# EAGLE design AirU_v2.2 (EAGLE 9.6.2)
COMPANY: ADAFRUIT INDUSTRIES; DRAWN: KTOWN; REV: B

## Sheet 1 of 2
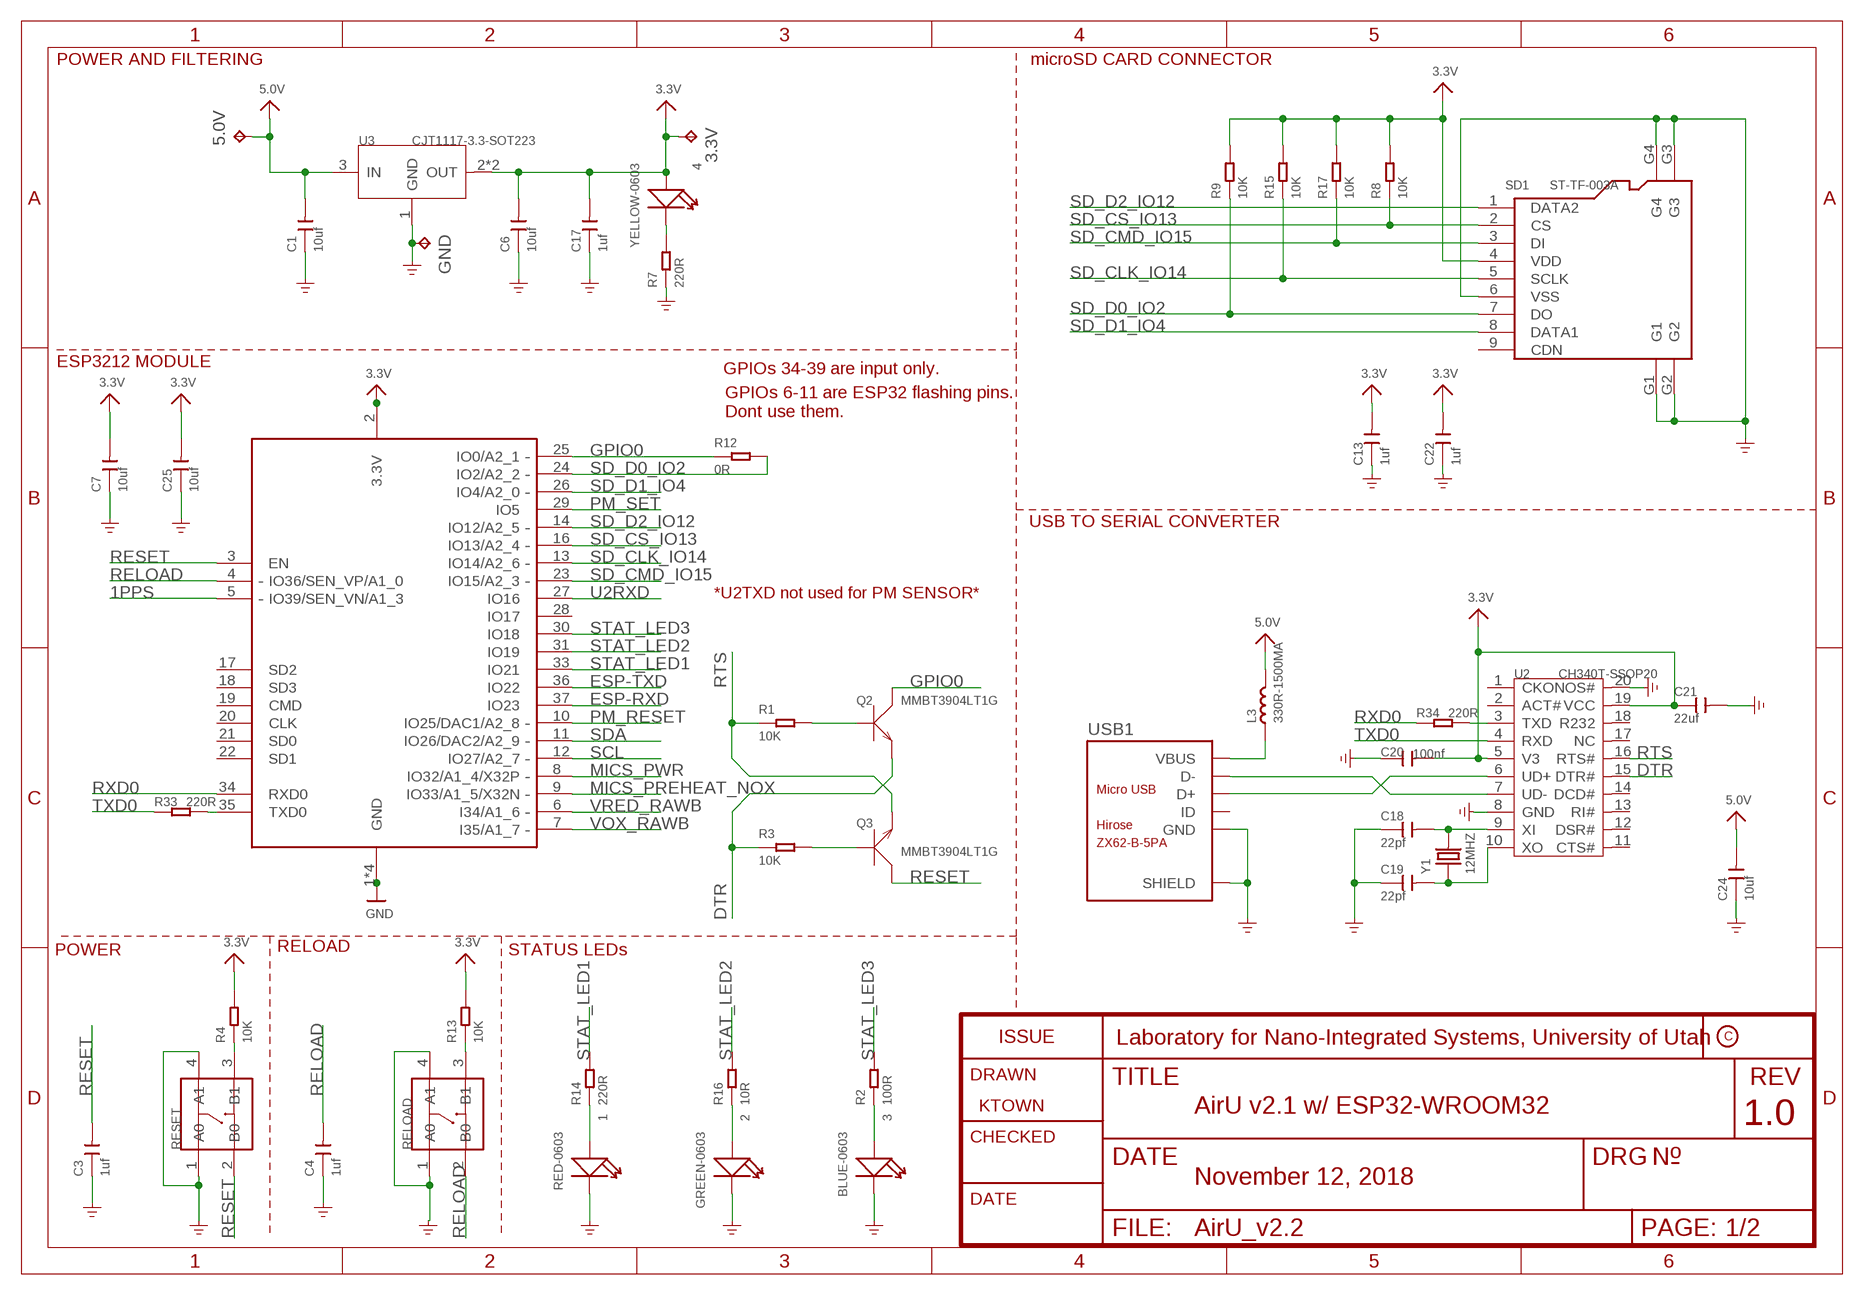
[diagram p0: schematic, sheet 1]
FRAME1 (FRAME_A4): COMPANY: TETRAD: SENSOR NETWORK SOLUTIONS, LLC; REV: 1.0

### Parts
1  RED-0603  LED-SMD-RED-DIFFUSED(0603)  [LED-0603]
2  GREEN-0603  SMD-LED-CLEAR-GREEN(0603)  [LED-0603]
3  BLUE-0603  SMD-LED-CLEAR-BLUE(0603)  [LED-0603]
3.3V  TPTP20SQ  [TP20SQ]
4  YELLOW-0603  SMD-LED-CLEAR-YELLOW(0603)  [LED-0603]
5.0V  TPTP20SQ  [TP20SQ]
C1  10uf  CERAMIC-10UF-10V-10%-X5R(0603)  [C0603]
C3  1uf  CERAMIC-1UF-25V-10%-X7R(0603)  [C0603]
C4  1uf  CERAMIC-1UF-25V-10%-X7R(0603)  [C0603]
C6  10uf  CERAMIC-10UF-10V-10%-X5R(0603)  [C0603]
C7  10uf  CERAMIC-10UF-10V-10%-X5R(0603)  [C0603]
C13  1uf  CERAMIC-1UF-25V-10%-X7R(0603)  [C0603]
C17  1uf  CERAMIC-1UF-25V-10%-X7R(0603)  [C0603]
C18  22pf  CERAMIC-22PF-50V-5%-NPO(0603)  [C0603]
C19  22pf  CERAMIC-22PF-50V-5%-NPO(0603)  [C0603]
C20  100nf  CERAMIC-100NF-50V-10%-X7R(0603)  [C0603]
C21  22uf  CERAMIC-22UF-6.3V-20%-X5R(0805)  [C0805]
C22  1uf  CERAMIC-1UF-25V-10%-X7R(0603)  [C0603]
C24  10uf  CERAMIC-10UF-10V-10%-X5R(0603)  [C0603]
C25  10uf  CERAMIC-10UF-10V-10%-X5R(0603)  [C0603]
GND  TPTP20SQ  [TP20SQ]
L3  330R-1500MA  SMD-FERRITE-BEAD-330R-1500MA(0805)'0805'  [L0805]
Q2  MMBT3904LT1G  SMD-TRANSISTORS-NPN-40V-200MA-MMBT3904LT1G(SOT-23)  [SOT-23]
Q3  MMBT3904LT1G  SMD-TRANSISTORS-NPN-40V-200MA-MMBT3904LT1G(SOT-23)  [SOT-23]
R1  10K  SMD-RES-10K-1%-1/10W(0603)  [R0603]
R2  100R  SMD-RES-100R-5%-1/10W(0603)  [R0603]
R3  10K  SMD-RES-10K-1%-1/10W(0603)  [R0603]
R4  10K  SMD-RES-10K-1%-1/10W(0603)  [R0603]
R7  220R  SMD-RES-220R-5%-1/10W(0603)  [R0603]
R8  10K  SMD-RES-10K-1%-1/10W(0603)  [R0603]
R9  10K  SMD-RES-10K-1%-1/10W(0603)  [R0603]
R12  0R  SMD-RES-0R-5%-1/10W(0603)  [R0603]
R13  10K  SMD-RES-10K-1%-1/10W(0603)  [R0603]
R14  220R  SMD-RES-220R-5%-1/10W(0603)  [R0603]
R15  10K  SMD-RES-10K-1%-1/10W(0603)  [R0603]
R16  10R  SMD-RES-10R-5%-1/10W(0603)  [R0603]
R17  10K  SMD-RES-10K-1%-1/10W(0603)  [R0603]
R33  220R  SMD-RES-220R-5%-1/10W(0603)  [R0603]
R34  220R  SMD-RES-220R-5%-1/10W(0603)  [R0603]
RELOAD  DIP-SWITCH-TACTILE-SPST-NO/TS-1109(4P-D6.0MM)'TS-1109'  [SW4-6.0X6.0X5.0MM]
RESET  DIP-SWITCH-TACTILE-SPST-NO/TS-1109(4P-D6.0MM)'TS-1109'  [SW4-6.0X6.0X5.0MM]
SD1  ST-TF-003A  MICRO-SD-CARD-SOCKET-9P(ST-TF-003A)  [MICRO-SD9+4P-SMD-16.1X14.5X1.85MM]
U2  CH340T-SSOP20  INTERFACE-CH340T(SSOP20)  [SSOP20-0.65-7.6X5.2MM]
U3  CJT1117-3.3-SOT223  PMIC-CJT1117-3.3(SOT223)  [SOT-223]
U7  ESP32_WROOM32_SKINNY  [WROOM32_SKINNY]
USB1  ZX62-B-5PA  MICRO-USB-SMD(ZX62-B-5PA)  [MICRO-USB5+6P-SMD-0.65-AB]
Y1  12MHZ  SMD-CRYSTAL-12MHZ-20PF-20PPM-40R(2P-5.0X3.2MM)  [X2-SMD-5.0X3.2X1.3MM]

### Nets
1PPS: U7.5(IO39/SEN_VN/A1_3) ; also sheet 2
3.3V: 3.3V.TP 4.+ C6.2 C7.2 C13.2 C17.2 C20.2 C21.1 C22.2 C25.2 R4.2 R8.2 R9.2 R13.2 R15.2 R17.2 SD1.4(VDD) U2.5(V3) U2.19(VCC) U3.2(OUT) U3.TER(OUT) U7.2(3.3V) ; also sheet 2
5.0V: 5.0V.TP C1.2 C24.2 L3.2 U3.3(IN) ; also sheet 2
DTR: Q2.2(E) R3.1 U2.15(DTR#)
ESP-RXD: U7.37(IO23) ; also sheet 2
ESP-TXD: U7.36(IO22) ; also sheet 2
GND: 1.- 2.- 3.- C1.1 C3.1 C4.1 C6.1 C7.1 C13.1 C17.1 C18.1 C19.1 C20.1 C21.2 C22.1 C24.1 C25.1 GND.TP R7.1 RELOAD.1(A0) RELOAD.4(A1) RESET.1(A0) RESET.4(A1) SD1.6(VSS) SD1.G1 SD1.G2 SD1.G3 SD1.G4 U2.8(GND) U2.20(NOS#) U3.1(GND) U7.1(GND) U7.15(GND) U7.38(GND) U7.P$1(GND) USB1.5(GND) USB1.P1(SHIELD) USB1.P2(SHIELD) USB1.P3_1(SHIELD) USB1.P3_2(SHIELD) USB1.P3_3(SHIELD) USB1.P4_1(SHIELD) USB1.P4_2(SHIELD) USB1.P4_3(SHIELD) USB1.P5(SHIELD) USB1.P6(SHIELD) ; supply symbol labelled GND_POWER ; also sheet 2
GPIO0: Q2.3(C) R12.1 U7.25(IO0/A2_1)
MICS_PREHEAT_NOX: U7.9(IO33/A1_5/X32N) ; also sheet 2
MICS_PWR: U7.8(IO32/A1_4/X32P) ; also sheet 2
N$1: 2.+ R16.1
N$7: 1.+ R14.1
N$12: Q3.1(B) R3.2
N$13: Q2.1(B) R1.2
N$22: 3.+ R2.1
N$25: 4.- R7.2
N$26: U2.7(UD-) USB1.2(D-)
N$27: U2.6(UD+) USB1.3(D+)
N$28: C18.2 U2.9(XI) Y1.2
N$29: C19.2 U2.10(XO) Y1.1
N$30: R34.2 U2.3(TXD)
N$33: R33.2 U7.35(TXD0)
N$37: R13.1 RELOAD.3(B1)
N$38: R4.1 RESET.3(B1)
PM_RESET: U7.10(IO25/DAC1/A2_8) ; also sheet 2
PM_SET: U7.29(IO5) ; also sheet 2
RELOAD: C4.2 RELOAD.2(B0) U7.4(IO36/SEN_VP/A1_0)
RESET: C3.2 Q3.3(C) RESET.2(B0) U7.3(EN)
RTS: Q3.2(E) R1.1 U2.16(RTS#)
RXD0: R34.1 U7.34(RXD0)
SCL: U7.12(IO27/A2_7) ; also sheet 2
SD_CLK_IO14: R15.1 SD1.5(SCLK) U7.13(IO14/A2_6)
SD_CMD_IO15: R17.1 SD1.3(DI) U7.23(IO15/A2_3)
SD_CS_IO13: R8.1 SD1.2(CS) U7.16(IO13/A2_4)
SD_D0_IO2: R9.1 R12.2 SD1.7(DO) U7.24(IO2/A2_2)
SD_D1_IO4: SD1.8(DATA1) U7.26(IO4/A2_0)
SD_D2_IO12: SD1.1(DATA2) U7.14(IO12/A2_5)
SDA: U7.11(IO26/DAC2/A2_9) ; also sheet 2
STAT_LED1: R14.2 U7.33(IO21)
STAT_LED2: R16.2 U7.31(IO19)
STAT_LED3: R2.2 U7.30(IO18)
TXD0: R33.1 U2.4(RXD)
U2RXD: U7.27(IO16) ; also sheet 2
VBUS: L3.1 USB1.1(VBUS)
VOX_RAWB: U7.7(I35/A1_7) ; also sheet 2
VRED_RAWB: U7.6(I34/A1_6) ; also sheet 2
Unconnected: SD1.9(CDN) U2.1(CKO) U2.2(ACT#) U2.11(CTS#) U2.12(DSR#) U2.13(RI#) U2.14(DCD#) U2.17(NC) U2.18(R232) U7.17(SD2) U7.18(SD3) U7.19(CMD) U7.20(CLK) U7.21(SD0) U7.22(SD1) U7.28(IO17) USB1.4(ID)

### Notes on the sheet
- POWER AND FILTERING | microSD CARD CONNECTOR
- ESP3212 MODULE
- GPIOs 34-39 are input only.
- GPIOs 6-11 are ESP32 flashing pins.
  Dont use them.
- -
- -
- -
- - | USB TO SERIAL CONVERTER
- -
- -
- - | -
- - | *U2TXD not used for PM SENSOR*
- -
- -
- -
- -
- -
- -
- -
- POWER | RELOAD | STATUS LEDs
- Laboratory for Nano-Integrated Systems, University of Utah
- AirU v2.1 w/ ESP32-WROOM32
- November 12, 2018

## Sheet 2 of 2
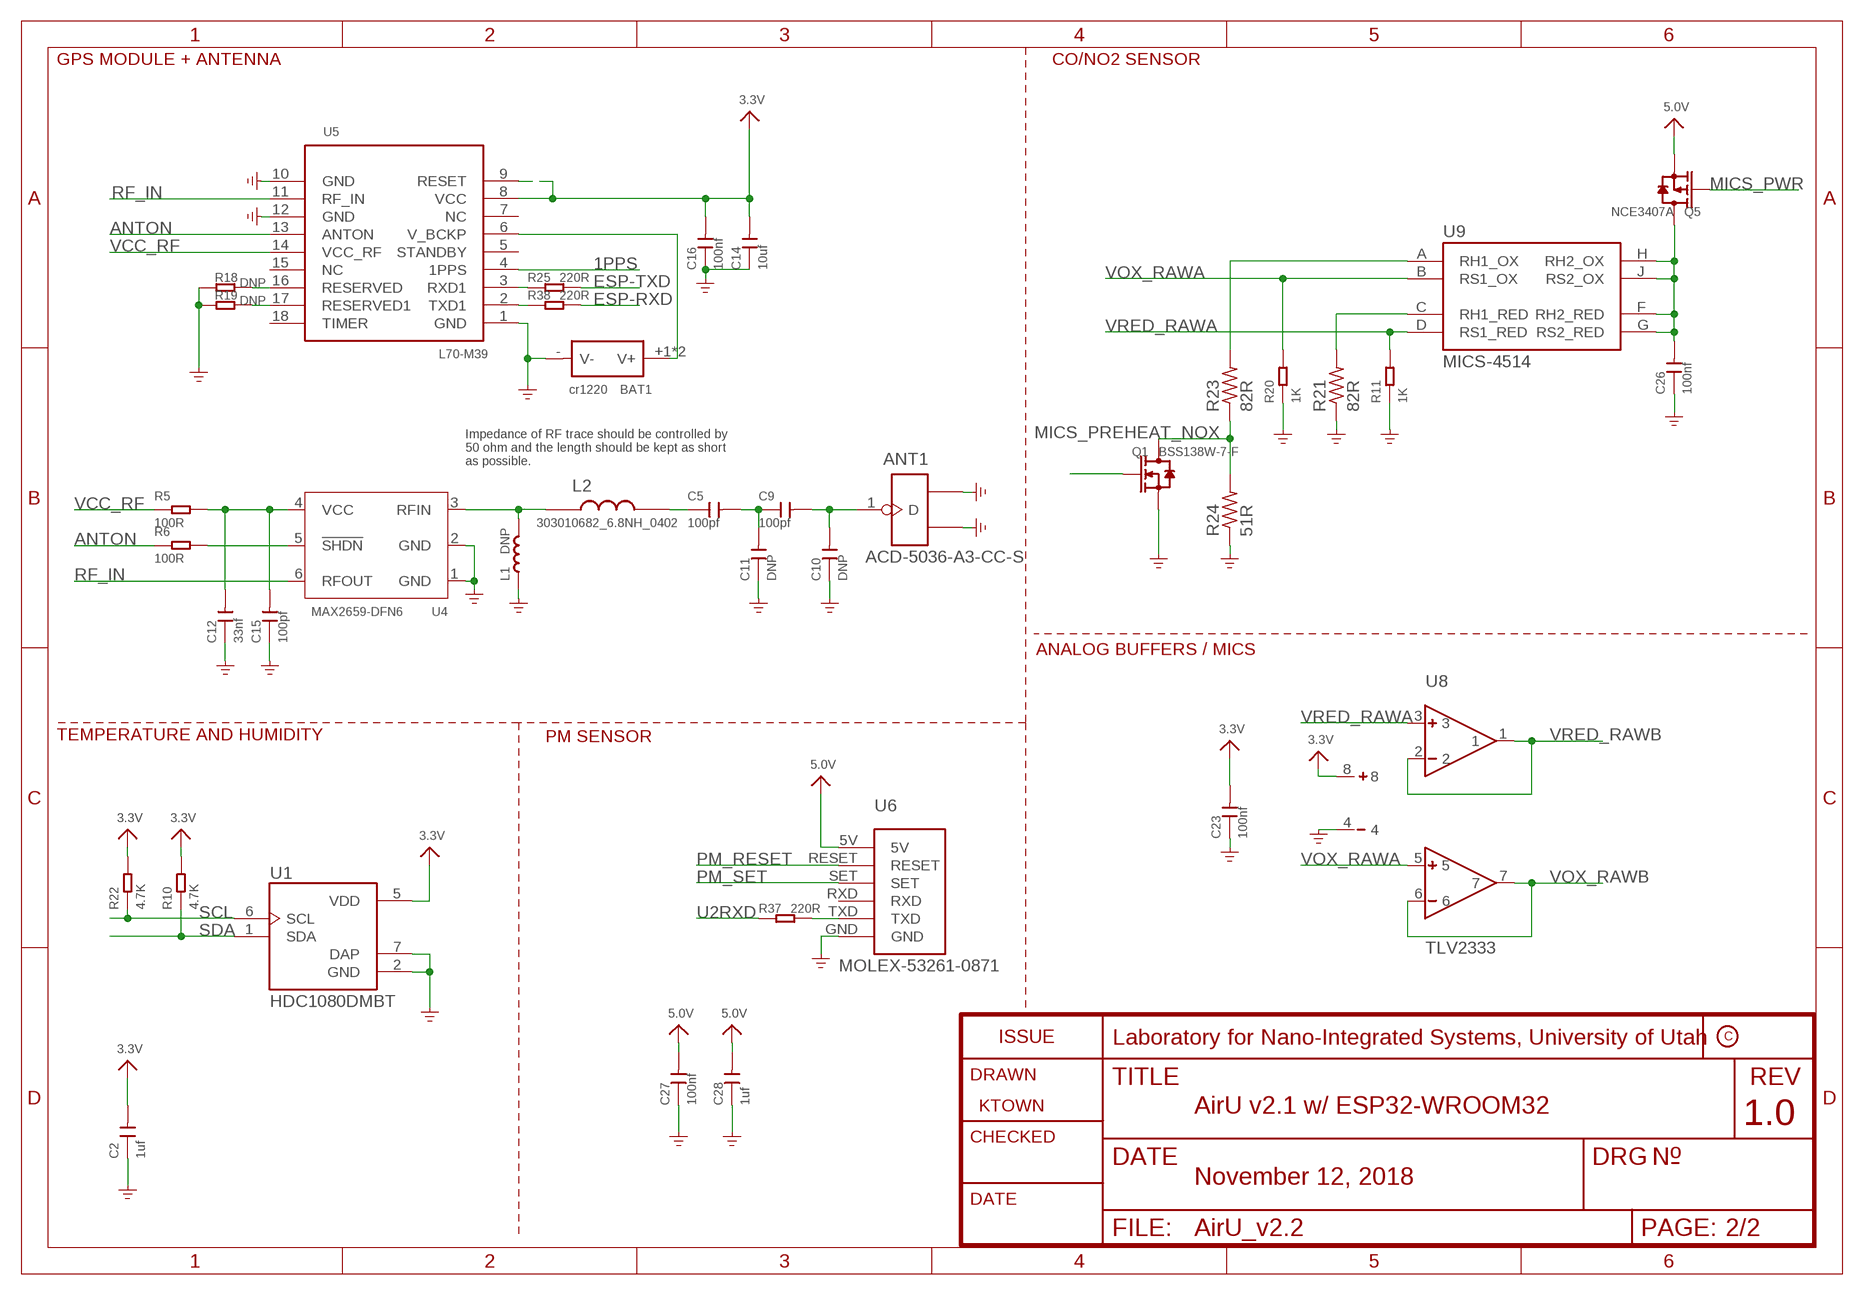
[diagram p1: schematic, sheet 2]
FRAME2 (FRAME_A4): COMPANY: TETRAD: SENSOR NETWORK SOLUTIONS, LLC; REV: 1.0
FRAME3 (FRAME_A4): COMPANY: TETRAD: SENSOR NETWORK SOLUTIONS, LLC; REV: 1.0

### Parts
ANT1  ACD-5036-A3-CC-S  ANTENNA-ACD5036  [ANT3-SMD-5.2X3.7X0.7MM]
BAT1  cr1220  DIP-BATTERY-CELL-HOLDER(1220)  [BAT2P-13.5-CR1220]
C2  1uf  CERAMIC-1UF-25V-10%-X7R(0603)  [C0603]
C5  100pf  CERAMIC-100PF-50V-5%-NPO(0603)  [C0603]
C9  100pf  CERAMIC-100PF-50V-5%-NPO(0603)  [C0603]
C10  DNP  CERAMIC-100PF-50V-5%-NPO(0603)  [C0603]
C11  DNP  CERAMIC-100PF-50V-5%-NPO(0603)  [C0603]
C12  33nf  CERAMIC-33NF-50V-10%-X7R(0603)  [C0603]
C14  10uf  CERAMIC-10UF-10V-10%-X5R(0603)  [C0603]
C15  100pf  CERAMIC-100PF-50V-5%-NPO(0603)  [C0603]
C16  100nf  CERAMIC-100NF-50V-10%-X7R(0603)  [C0603]
C23  100nf  CERAMIC-100NF-50V-10%-X7R(0603)  [C0603]
C26  100nf  CERAMIC-100NF-50V-10%-X7R(0603)  [C0603]
C27  100nf  CERAMIC-100NF-50V-10%-X7R(0603)  [C0603]
C28  1uf  CERAMIC-1UF-25V-10%-X7R(0603)  [C0603]
L1  DNP  INDUCTOR/FERRITE-BEAD-0201  [L0201]
L2  303010682_6.8NH_0402  [L0402]
Q1  BSS138W-7-F  SMD-MOSFET-N-CH-50V-200MA-BSS138W-7-F(SOT-23)  [SOT-23]
Q5  NCE3407A  SMD-MOSFET-P-CH-VDC=30V-ID=4.3A-NCE3407A(SOT-23)  [SOT-23]
R5  100R  SMD-RES-100R-5%-1/10W(0603)  [R0603]
R6  100R  SMD-RES-100R-5%-1/10W(0603)  [R0603]
R10  4.7K  SMD-RES-4.7K-5%-1/10W(0603)  [R0603]
R11  1K  SMD-RES-1K-1%-1/10W(0603)  [R0603]
R18  DNP  SMD-RES-10K-1%-1/10W(0603)  [R0603]
R19  DNP  SMD-RES-10K-1%-1/10W(0603)  [R0603]
R20  1K  SMD-RES-1K-1%-1/10W(0603)  [R0603]
R21  82R  R-US_R0603  [R0603]
R22  4.7K  SMD-RES-4.7K-5%-1/10W(0603)  [R0603]
R23  82R  R-US_R0603  [R0603]
R24  51R  R-US_R0603  [R0603]
R25  220R  SMD-RES-220R-5%-1/10W(0603)  [R0603]
R37  220R  SMD-RES-220R-5%-1/10W(0603)  [R0603]
R38  220R  SMD-RES-220R-5%-1/10W(0603)  [R0603]
U1  HDC1080DMBT  [SON100P300X300X80-7N]
U4  MAX2659-DFN6  AMPLIFIER-MAX2659  [DFN6-0.5-1.5X1.2X0.72MM]
U5  L70-M39  MOUDLE-GPS-L70-HARDWARE  [LGA18-1.1-9.7X10.1X2.5MM]
U6  MOLEX-53261-0871  [MOLEX-53261-0871]
U8  TLV2333  [TLV2333]
U9  MICS-4514  [MICS_10-SMD]

### Nets
1PPS: U5.4(1PPS) ; also sheet 1
3.3V: C2.2 C14.2 C16.2 C23.2 R10.2 R22.2 U1.5(VDD) U5.8(VCC) U5.9(RESET) U8.8 ; also sheet 1
5.0V: C27.2 C28.2 Q5.2(S) U6.5V ; also sheet 1
ANTON: R6.1 U5.13(ANTON)
ESP-RXD: R38.2 ; also sheet 1
ESP-TXD: R25.2 ; also sheet 1
GND: ANT1.2(GND1) ANT1.3(GND2) BAT1.-(V-) C2.1 C10.1 C11.1 C12.1 C14.1 C15.1 C16.1 C23.1 C26.1 C27.1 C28.1 L1.1 Q1.2(S) R11.1 R18.1 R19.1 R20.1 R21.1 R24.1 U1.2(GND) U1.7(DAP) U4.1(GND) U4.2(GND) U5.1(GND) U5.10(GND) U5.12(GND) U6.GND U8.4 ; supply symbol labelled GND_POWER ; also sheet 1
MICS_PREHEAT_NOX: Q1.1(G) ; also sheet 1
MICS_PWR: Q5.1(G) ; also sheet 1
N$2: R21.2 U9.C(RH1_RED)
N$3: C5.2 C9.1 C11.2
N$4: ANT1.1(D) C9.2 C10.2
N$5: L1.2 L2.P$1 U4.3(RFIN)
N$6: R23.2 U9.A(RH1_OX)
N$8: C5.1 L2.P$2
N$9: R6.2 U4.5(!SHDN)
N$10: C12.2 C15.2 R5.2 U4.4(VCC)
N$11: R18.2 U5.16(RESERVED)
N$14: R19.2 U5.17(RESERVED1)
N$23: Q1.3(D) R23.1 R24.2
N$24: C26.2 Q5.3(D) U9.F(RH2_RED) U9.G(RS2_RED) U9.H(RH2_OX) U9.J(RS2_OX)
N$36: R37.2 U6.TXD
PM_RESET: U6.RESET ; also sheet 1
PM_SET: U6.SET ; also sheet 1
RF_IN: U4.6(RFOUT) U5.11(RF_IN)
SCL: R22.1 U1.6(SCL) ; also sheet 1
SDA: R10.1 U1.1(SDA) ; also sheet 1
U1RXD: R25.1 U5.3(RXD1)
U1TXD: R38.1 U5.2(TXD1)
U2RXD: R37.1 ; also sheet 1
V_BCKP: BAT1.+1(V+) BAT1.+2(V+) U5.6(V_BCKP)
VCC_RF: R5.1 U5.14(VCC_RF)
VOX_RAWA: R20.2 U8.5 U9.B(RS1_OX)
VOX_RAWB: U8.6 U8.7 ; also sheet 1
VRED_RAWA: R11.2 U8.3 U9.D(RS1_RED)
VRED_RAWB: U8.1 U8.2 ; also sheet 1
Unconnected: U5.5(STANDBY) U5.7(NC) U5.15(NC) U5.18(TIMER) U6.RXD

### Notes on the sheet
- GPS MODULE + ANTENNA | CO/NO2 SENSOR
- Impedance of RF trace should be controlled by 
  50 ohm and the length should be kept as short 
  as possible.
- ANALOG BUFFERS / MICS
- TEMPERATURE AND HUMIDITY | PM SENSOR
- Laboratory for Nano-Integrated Systems, University of Utah
- AirU v2.1 w/ ESP32-WROOM32
- November 12, 2018

## Library data of the parts
1 = Seeed-LED:LED-SMD-RED-DIFFUSED(0603): 304090042; MPN: 19-217-R6C-AL1M2VY-3T
2 = Seeed-LED:SMD-LED-CLEAR-GREEN(0603): 304090043; MPN: 19-217-G7C-AN1P2-3T
3 = Seeed-LED:SMD-LED-CLEAR-BLUE(0603): 304090045; MPN: 19-217-BHC-ZL1M2RY-3T
3.3V 5.0V GND = testpad:TP: Test pad
4 = Seeed-LED:SMD-LED-CLEAR-YELLOW(0603): 304090044; MPN: 19-217-Y5C-AM1N1VY-3T
ANT1 = Connector-new:ANTENNA-ACD5036; MPN: ACD-5036-A3-CC-S
BAT1 = Seeed-Connector:DIP-BATTERY-CELL-HOLDER(1220): 320170002
C1 C6 C7 C14 C24 C25 = Seeed-Capacitor:CERAMIC-10UF-10V-10%-X5R(0603): 302010103; MPN: CC0603KRX5R6BB106
C2-C4 C13 C17 C22 C28 = Seeed-Capacitor:CERAMIC-1UF-25V-10%-X7R(0603): 302010139; MPN: CC0603KRX7R8BB105
C5 C9 C15 = Seeed-Capacitor:CERAMIC-100PF-50V-5%-NPO(0603): 302010076; MPN: CC0603JRNPO9BN101
C10 C11 = Seeed-Capacitor:CERAMIC-100PF-50V-5%-NPO(0603): 302010076; MPN: CC0603JRNPO9BN101; VALUE: 100pf
C12 = Seeed-Capacitor:CERAMIC-33NF-50V-10%-X7R(0603): 302010088; MPN: CC0603KRX7R9BB333
C16 C20 C23 C26 C27 = Seeed-Capacitor:CERAMIC-100NF-50V-10%-X7R(0603): 302010138; MPN: CC0603KRX7R9BB104
C18 C19 = Seeed-Capacitor:CERAMIC-22PF-50V-5%-NPO(0603): 302010143; MPN: CC0603JRNPO9BN220
C21 = Seeed-Capacitor:CERAMIC-22UF-6.3V-20%-X5R(0805): 302010171; MPN: CC0805MKX5R5BB226
L1 = Discrete-new:INDUCTOR/FERRITE-BEAD
L2 = Seeed-OPL-2017-01-Inductor-Akita:303010682_6.8NH_0402: Murata;LQW15AN6N8G00D, SMD Inductor 6.8nH-2%-700mA;0402, SKU: 303010682
L3 = Seeed-Inductor:SMD-FERRITE-BEAD-330R-1500MA(0805): 303030006; MPN: BLM21PG331SN1D
Q1 = Seeed-Transistor:SMD-MOSFET-N-CH-50V-200MA-BSS138W-7-F(SOT-23): 305030000; MPN: BSS138W-7-F
Q2 Q3 = Seeed-Transistor:SMD-TRANSISTORS-NPN-40V-200MA-MMBT3904LT1G(SOT-23): 305010013; MPN: MMBT3904LT1G
Q5 = Seeed-Transistor:SMD-MOSFET-P-CH-VDC=30V-ID=4.3A-NCE3407A(SOT-23): 305030010; MPN: NCE3407A
R1 R3 R4 R8 R9 R13 R15 R17 = Seeed-Resistor:SMD-RES-10K-1%-1/10W(0603): 301010299; MPN: RC0603FR-0710KL
R2 R5 R6 = Seeed-Resistor:SMD-RES-100R-5%-1/10W(0603): 301010090; MPN: RC0603JR-07100RL
R7 R14 R25 R33 R34 R37 R38 = Seeed-Resistor:SMD-RES-220R-5%-1/10W(0603): 301010163; MPN: RC0603JR-07220RL
R10 R22 = Seeed-Resistor:SMD-RES-4.7K-5%-1/10W(0603): 301010290; MPN: RC0603JR-074K7L
R11 R20 = Seeed-Resistor:SMD-RES-1K-1%-1/10W(0603): 301010298; MPN: RC0603FR-071KL
R12 = Seeed-Resistor:SMD-RES-0R-5%-1/10W(0603): 301010292; MPN: RC0603JR-070RL
R16 = Seeed-Resistor:SMD-RES-10R-5%-1/10W(0603): 301010096; MPN: RC0603JR-0710RL
R18 R19 = Seeed-Resistor:SMD-RES-10K-1%-1/10W(0603): 301010299; MPN: RC0603FR-0710KL; VALUE: 10K
R21 R23 R24 = rcl:R-US_: RESISTOR, American symbol; SPICEPREFIX: R
RELOAD RESET = Seeed-Switch:DIP-SWITCH-TACTILE-SPST-NO/TS-1109(4P-D6.0MM): 311020024
SD1 = Seeed-Connector:MICRO-SD-CARD-SOCKET-9P(ST-TF-003A): 320090000; MPN: ST-TF-003A
U1 = HDC1080DMBT_TITempHum:HDC1080DMBT: HDC1080 Low Power, High Accuracy Digital Humidity Sensor with Temperature Sensor 6-WSON -40 to 125; DESCRIPTION: HDC1080 Low Power, High Accuracy Digital Humidity Sensor with Temperature Sensor 6-WSON -40 to 125; DIGI-KEY_PART_NUMBER: 296-43864-1-ND; DIGI-KEY_PURCHASE_URL: https://www.digikey.com/product-detail/en/texas-instruments/HDC1080DMBT/296-43864-1-ND/5878615?utm_source=snapeda&utm_medium=aggregator&utm_campaign=symbol; MF: Texas Instruments; MP: HDC1080DMBT; PACKAGE: WDFN-6 Texas Instruments
U2 = Seeed-IC:INTERFACE-CH340T(SSOP20): 310070026; MPN: CH340T
U3 = Seeed-IC:PMIC-CJT1117-3.3(SOT223): 310030097; MPN: CJT1117-3.3
U4 = IC-new:AMPLIFIER-MAX2659: GPS/GNSS Low-Noise Amplifier; MPN: MAX2659
U5 = moudle-new:MOUDLE-GPS-L70-HARDWARE: L70 GPS module; MPN: L70; VALUE: L70
U6 = Molex_53261_0871_Connector:MOLEX-53261-0871
U7 = microbuilder:ESP32_WROOM32
U8 = tlv2333:TLV2333
U9 = MICS-4514:MICS-4514: Metal oxide MEMS carbon monoxide (CO) and NOx sensor in an SMD package.; AVAILABILITY: Unavailable; MF: Amphenol; MP: MICS-4514; PACKAGE: None; PRICE: 11.82 USD
USB1 = Seeed-Connector:MICRO-USB-SMD(ZX62-B-5PA): 320010005; MPN: ZX62-B-5PA
Y1 = Seeed-Crystal Oscillator:SMD-CRYSTAL-12MHZ-20PF-20PPM-40R(2P-5.0X3.2MM): 306010047; MPN: 5032/2P

## Board
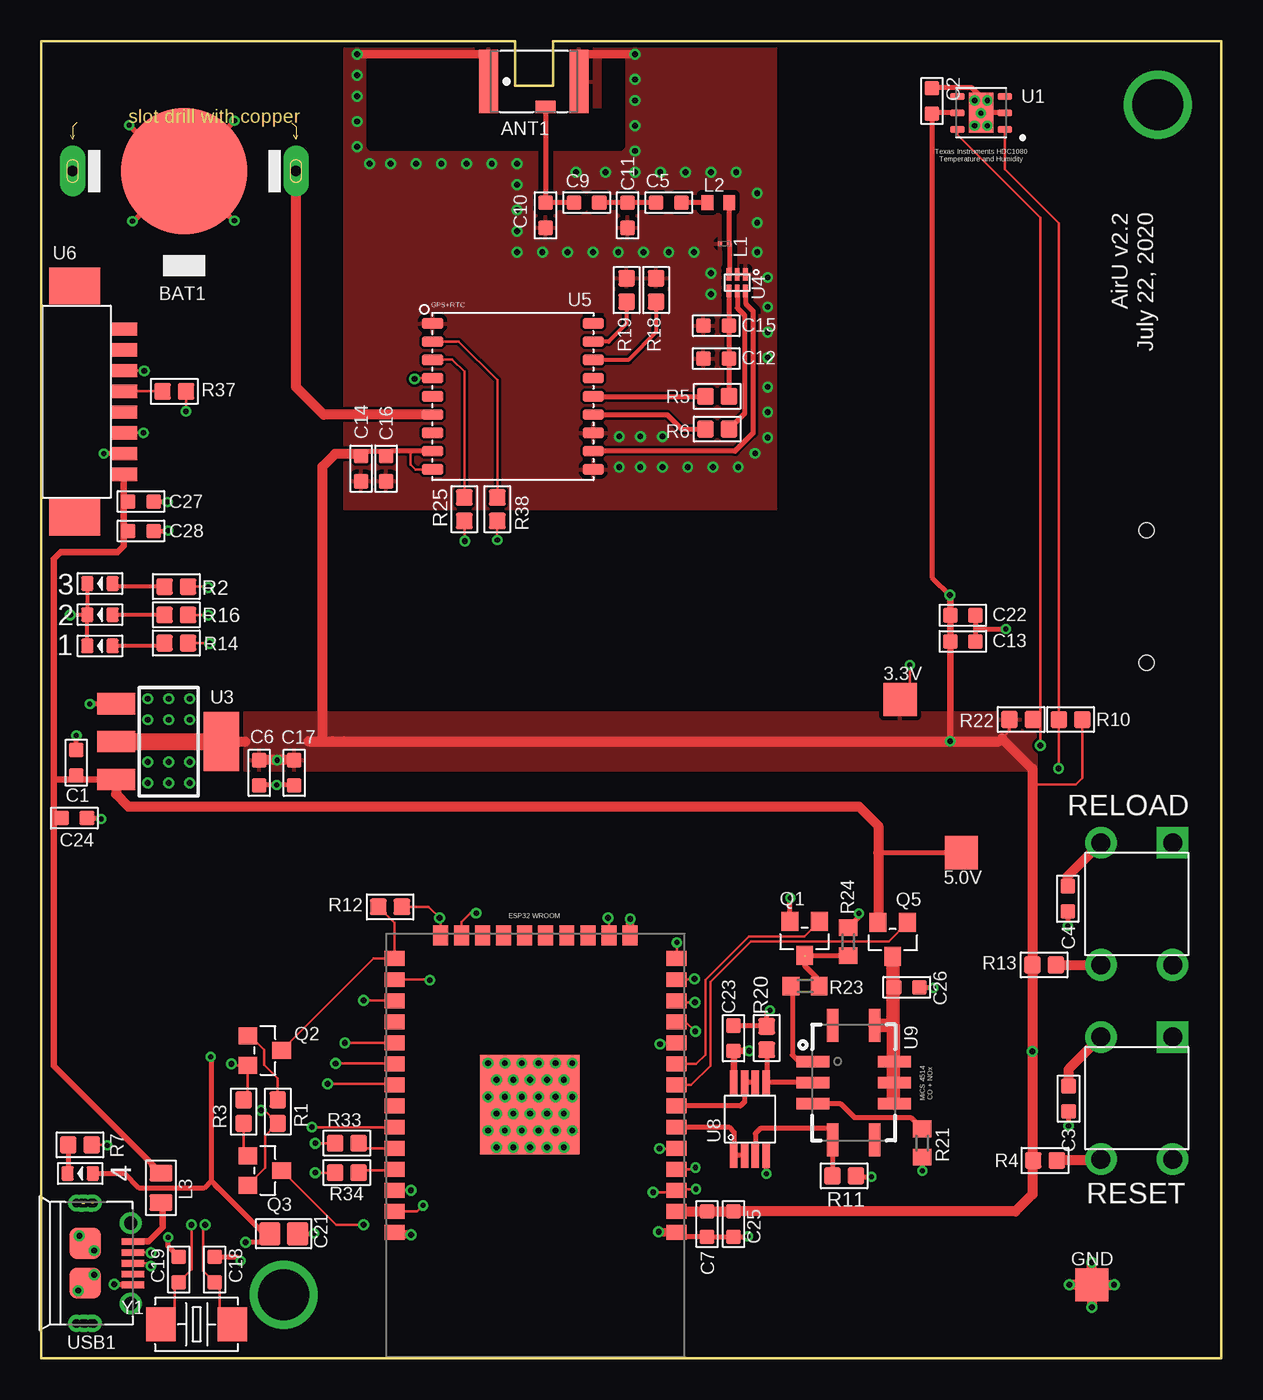
[diagram p2: board, top side]
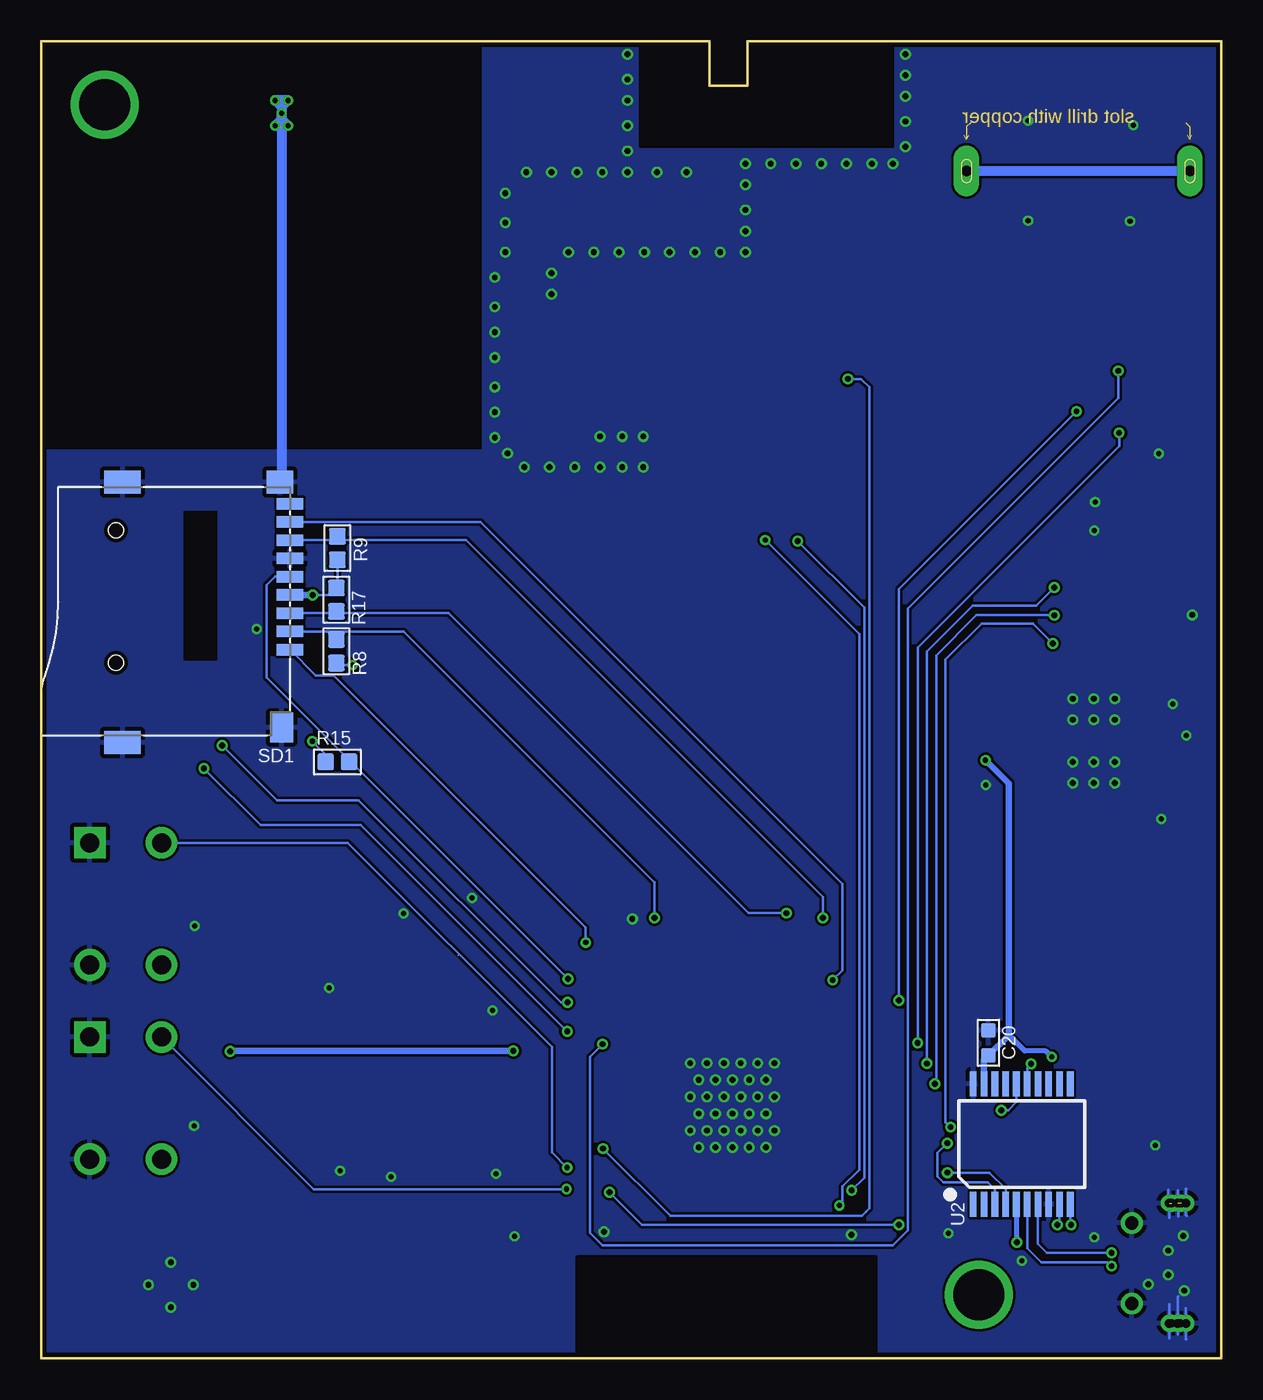
[diagram p3: board, bottom side, seen from below]

Size 71.12 x 79.38 mm. Coordinates in mm from the lower left corner, seen from the top.
Outline: 71.12,79.38 71.12,0 0,0 0,79.38
Outline: 71.12,79.38 30.84,79.38
Outline: 28.55,79.38 0,79.38
Outline: 0,79.38 28.55,79.38
Outline: 28.55,79.38 28.55,76.71 30.84,76.71 30.84,79.38
Outline: 30.84,79.38 71.12,79.38
Copper layers (1*16): Top 0.035mm / dielectric 1.5mm / Bottom 0.035mm
Design rules "seeed-studio-2-layer": minimum track width 6mil, minimum drill 12mil, track to track 6mil, track to pad 6mil, pad to pad 6mil, via to via 6mil, smd to smd 0mil, copper to edge 10mil, drill to drill 10mil, minimum pad ring 10mil, minimum via ring 6mil, stop-mask expansion 2mil, vias tented up to drill 100mil, thermal gap 10mil
tRestrict: area 20.8,0.1 to 38.8,6.1
bRestrict: area 20.8,0.1 to 38.8,6.1; area 19.9,73.1 to 34.9,79.4; area 19.8,73 to 35,79.4

### Footprints (pad centres in the part's own frame; a part is rotated, then mirrored left to right if it is on the bottom)
LED-0603 = smd 0.762 x 0.889: + -0.762,0; - 0.762,0
TP20SQ = smd 2 x 2: TP 0,0
ANT3-SMD-5.2X3.7X0.7MM = smd 0.75 x 1.2: 1 1.525,0.7 | smd 3.8 x 1.15: 2 0,2.725; 3 0,-2.725
BAT2P-13.5-CR1220 = drill 0.635 pad 1.524 long: +1 6.731,0; +2 -6.731,0 | smd 7.62 x 7.62: - 0,0
C0603 = smd 0.889 x 0.889: 1 0,0.762; 2 0,-0.762
C0805 = smd 1.397 x 1.27: 1 0,0.835; 2 0,-0.835
L0201 = smd 0.279 x 0.318: 1 -0.279,0; 2 0.279,0
L0402 = smd 0.7 x 0.9: P$1 -0.65,0; P$2 0.65,0
L0805 = smd 1.016 x 1.397: 1 -0.889,0; 2 0.889,0
SOT-23 = smd 1.016 x 1.143: 1 -0.889,-1.016; 2 0.889,-1.016; 3 0,1.016
R0603 = smd 1.016 x 1.016: 1 0,0.708; 2 0,-0.708
R0603' = smd 1 x 1.1: 1 -0.85,0; 2 0.85,0
SW4-6.0X6.0X5.0MM = drill 1.143 pad 1.905 square: 1 -3.683,2.159 | drill 1.143 pad 1.905: 2 -3.683,-2.159; 3 3.683,-2.159; 4 3.683,2.159
MICRO-SD9+4P-SMD-16.1X14.5X1.85MM = smd 1.6 x 0.7: 1 0,2.25; 2 0,1.15; 3 0,0.05; 4 0,-1.05; 5 0,-2.15; 6 0,-3.25; 7 0,-4.35; 8 0,-5.45; 9 0,-6.55 | smd 1.6 x 1.4: G1 0.6,-7.85 | smd 2.2 x 1.4: G2 10.1,-7.85; G3 10.1,7.85 | smd 1.4 x 1.8: G4 0.5,6.95 | hole 0.9: 10.5,-4.95; 10.5,3.05
SON100P300X300X80-7N = smd 0.86 x 0.42: 1 -1.435,1; 2 -1.435,0; 3 -1.435,-1; 4 1.435,-1; 5 1.435,0; 6 1.435,1 | smd 1.5 x 2.4: 7 0,0
SSOP20-0.65-7.6X5.2MM = smd 0.4 x 1.5: 1 -2.925,-3.625; 2 -2.275,-3.625; 3 -1.625,-3.625; 4 -0.975,-3.625; 5 -0.325,-3.625; 6 0.325,-3.625; 7 0.975,-3.625; 8 1.625,-3.625; 9 2.275,-3.625; 10 2.925,-3.625; 11 2.925,3.625; 12 2.275,3.625; 13 1.625,3.625; 14 0.975,3.625; 15 0.325,3.625; 16 -0.325,3.625; 17 -0.975,3.625; 18 -1.625,3.625; 19 -2.275,3.625; 20 -2.925,3.625
SOT-223 = smd 1.27 x 2.286: 1 -2.286,-3.175; 2 0,-3.175; 3 2.286,-3.175 | smd 3.556 x 2.159: TER 0,3.175
DFN6-0.5-1.5X1.2X0.72MM = smd 0.3 x 0.75: 1 -0.5,-0.5; 2 0,-0.5; 3 0.5,-0.5; 4 0.5,0.5; 5 0,0.5; 6 -0.5,0.5
LGA18-1.1-9.7X10.1X2.5MM = smd 1.27 x 0.635: 1 4.85,-4.4; 2 4.85,-3.3; 3 4.85,-2.2; 4 4.85,-1.1; 5 4.85,0; 6 4.85,1.1; 7 4.85,2.2; 8 4.85,3.3; 9 4.85,4.4; 10 -4.85,4.4; 11 -4.85,3.3; 12 -4.85,2.2; 13 -4.85,1.1; 14 -4.85,0; 15 -4.85,-1.1; 16 -4.85,-2.2; 17 -4.85,-3.3; 18 -4.85,-4.4
MOLEX-53261-0871 = smd 0.8 x 1.6: 5V 4.375,0.8; GND 3.125,0.8; NC@1 -4.375,0.8; NC@2 -3.125,0.8; RESET -1.875,0.8; RXD 0.625,0.8; SET 1.875,0.8; TXD -0.625,0.8 | smd 2.2 x 3.1: NC@3 -6.975,-2.16; NC@4 6.975,-2.16
WROOM32_SKINNY = smd 1.2 x 0.9: 1 -8.5,5; 2 -8.5,3.73; 3 -8.5,2.46; 4 -8.5,1.19; 5 -8.5,-0.08; 6 -8.5,-1.35; 7 -8.5,-2.62; 8 -8.5,-3.89; 9 -8.5,-5.16; 10 -8.5,-6.43; 11 -8.5,-7.7; 12 -8.5,-8.97; 13 -8.5,-10.24; 14 -8.5,-11.51; 25 8.5,-11.51; 26 8.5,-10.24; 27 8.5,-8.97; 28 8.5,-7.7; 29 8.5,-6.43; 30 8.5,-5.16; 31 8.5,-3.89; 32 8.5,-2.62; 33 8.5,-1.35; 34 8.5,-0.08; 35 8.5,1.19; 36 8.5,2.46; 37 8.5,3.73; 38 8.5,5 | smd 0.9 x 1.2: 15 -5.7,-12.9; 16 -4.43,-12.9; 17 -3.16,-12.9; 18 -1.89,-12.9; 19 -0.62,-12.9; 20 0.65,-12.9; 21 1.92,-12.9; 22 3.19,-12.9; 23 4.46,-12.9; 24 5.73,-12.9 | smd 6 x 6: P$1 0.34,-2.7
TLV2333 = smd 1.45 x 0.45: 1 0.725,2.175; 2 0.725,1.525; 3 0.725,0.875; 4 0.725,0.225; 5 5.125,0.225; 6 5.125,0.875; 7 5.125,1.525; 8 5.125,2.175
MICS_10-SMD = smd 0.7 x 2: A 1.27,2.45; B 0,2.45; C -1.27,2.45; F -1.27,-2.45; G 0,-2.45; H 1.27,-2.45 | smd 2 x 0.7: D -3.45,1.27; E -3.45,-1.27; J 3.45,-1.27; K 3.45,1.27
MICRO-USB5+6P-SMD-0.65-AB = smd 0.4 x 1.35: 1 -1.3,2.875; 2 -0.65,2.875; 3 0,2.875; 4 0.65,2.875; 5 1.3,2.875 | smd 1.9 x 1.9: P1 -1.2,0; P2 1.2,0 | drill 0.508 pad 1.016: P3_1 -3.625,-0.533; P3_2 -3.625,-0.025; P3_3 -3.625,0.483; P4_1 3.625,-0.533; P4_2 3.625,-0.025; P4_3 3.625,0.483 | drill 0.8: P5 -2.425,2.73; P6 2.425,2.73
X2-SMD-5.0X3.2X1.3MM = smd 1.778 x 2.032: 1 -2.159,0; 2 2.159,0

### Placement (x,y rotation side)
1  3.53,42.93 180 top
2  3.53,44.81 180 top
3  3.53,46.69 180 top
3.3V  51.77,39.71 0 top
4  2.34,11.13 180 top
5.0V  55.46,30.46 0 top
ANT1  29.69,76.96 270 top
BAT1  8.61,71.56 180 top
C1  2.11,35.89 0 top
C2  53.69,75.79 0 top
C3  61.93,15.63 180 top
C4  61.87,27.69 180 top
C5  37.82,69.66 270 top
C6  13.13,35.28 180 top
C7  40.13,8.08 180 top
C9  32.87,69.66 270 top
C10  30.39,68.9 180 top
C11  35.34,68.9 180 top
C12  40.68,60.26 90 top
C13  55.55,43.21 270 top
C14  19.28,53.62 180 top
C15  40.68,62.23 90 top
C16  20.78,53.62 180 top
C17  15.24,35.28 180 top
C18  10.44,5.33 0 top
C19  8.28,5.33 0 top
C20  14.02,19 0 bottom
C21  14.61,7.49 90 top
C22  55.55,44.78 270 top
C23  41.73,19.28 0 top
C24  1.98,32.55 270 top
C25  41.73,8.08 180 top
C26  52.17,22.35 270 top
C27  5.99,51.64 270 top
C28  5.99,49.86 270 top
GND  63.32,4.42 0 top
L1  41.19,67.18 0 top
L2  40.81,69.66 180 top
L3  7.2,10.26 90 top
Q1  46.01,25.3 180 top
Q2  13.46,18.54 270 top
Q3  13.46,11.3 270 top
Q5  51.32,25.23 180 top
R1  14.25,14.86 180 top
R2  8.13,46.51 90 top
R3  12.19,14.86 0 top
R4  60.5,11.91 270 top
R5  40.74,57.98 90 top
R6  40.74,56.01 90 top
R7  2.32,12.85 270 top
R8  53.34,42.61 0 bottom
R9  53.28,48.83 0 bottom
R10  62.05,38.49 90 top
R11  48.4,10.99 270 top
R12  21.02,27.2 90 top
R13  60.45,23.7 270 top
R14  8.13,43.1 90 top
R15  53.28,35.94 270 bottom
R16  8.13,44.81 90 top
R17  53.34,45.72 180 bottom
R18  37.06,64.39 0 top
R19  35.28,64.39 0 top
R20  43.73,19.29 0 top
R21  82R  [R0603']  53.1,12.97 90 top
R22  59.06,38.5 270 top
R23  82R  [R0603']  46.04,22.43 180 top
R24  51R  [R0603']  48.64,25.11 270 top
R25  25.5,51.18 0 top
R33  18.41,11.18 90 top
R34  18.41,12.95 270 top
R37  8.01,58.28 270 top
R38  27.49,51.18 0 top
RELOAD  66.04,27.38 270 top
RESET  66.04,15.67 270 top
SD1  56.13,44.96 180 bottom
U1  56.65,75.07 180 top
U2  12.01,12.9 0 bottom
U3  7.67,37.16 270 top
U4  41.95,64.83 180 top
U5  28.42,57.98 180 top
U6  4.17,57.66 270 top
U7  29.78,12.57 180 top
U8  43.92,11.48 90 top
U9  48.97,16.61 90 top
USB1  2.65,5.71 270 top
Y1  9.36,2.03 0 top

### Tracks (layer width: path | path; a pad name or v marks a point on that pad's centre or on a via)
1PPS  (via drill 0.35)
  Top 0.152: U5.4 22.55,59.08 v22.5,59.03 | v37.26,12.62 38.25,12.62 U7.5
  Bottom 0.152: v22.5,59.03 21.72,59.03 21.21,58.52 21.21,9.02 21.4,8.83 21.67,8.56 33.2,8.56 v37.26,12.62
3.3V  (via drill 0.3, 0.35)
  Top 0.152: U5.9 22.55,53.58 22.25,53.87 22.25,54.67 | R22.2 58.35,37.81 57.91,37.36 57.73,37.19 | 59.74,34.59 62.37,34.59 62.76,34.97 R10.2 | v52.35,41.78 52.35,40.29 3.3V.TP
  Top 0.305: v12.32,6.99 13.26,6.99 C21.1 13.41,7.49 10.24,10.67 | U5.8 22.25,54.67 21.04,54.67 C16.2 20.5,54.66 19.56,54.66 C14.2 | U1.5 53.69,75.07 C2.2 53.69,47.07 54.79,45.97 | 10.7,10.21 10.24,10.67 | v10.21,18.16 10.24,18.14 10.24,10.67 | 4.+ 5,11.12 5.89,10.23 5.9,10.24 9.8,10.24 10.24,10.67 | R4.2 59.8,18.44 v59.74,18.49
  Top 0.406: U8.8 41.74,18.51 C23.2 v42.67,18.52 | v54.79,37.19 54.79,41.88 C13.2 C22.2 54.79,45.97 v54.76,46
  Top 0.61: U3.TER 12.29,37.16 | C17.2 v14.2,36.04 C6.2 | U7.2 C7.2 C25.2 | C25.2 | R13.2 | R13.2 v59.74,18.49 59.74,9.86 58.73,8.84 C25.2 | 57.91,37.36 59.74,35.52 59.74,34.59 59.74,34.33 R13.2 | 16.1,37.19 16.76,37.19 17.5,37.19 17.58,37.19 | 17.58,37.19 16.94,37.19 16.94,53.75 17.7,54.51 19.15,54.51 C14.2 | 17.58,37.19 18.24,37.19 v54.79,37.19 57.73,37.19
  Top 1.016: U3.2 U3.TER
  Bottom 0.152: v54.76,46 53.77,46 R17.2 53.28,46.49 R9.2 | 53.36,41.88 R8.2 53.22,41.78 v52.35,41.78 | R15.2 53.98,36.37 54.79,37.18 v54.79,37.19
  Bottom 0.305: U2.5 12.34,7 v12.32,6.99 | 14.29,16.69 U2.19 | 13.84,18.06 C20.2 | v10.21,18.16 10.57,18.52 11.84,18.52 12.78,19.46 12.8,19.46
  Bottom 0.406: v42.67,18.52 59.72,18.52 v59.74,18.49 | v54.76,46 54.77,46.01 SD1.4 | C20.2 14.02,18.34 | v14.2,36.04 12.8,34.65 12.8,19.46 C20.2 | U2.19 14.29,17.97 C20.2
  pour Top (rank 3): 9.75,38.94 60.02,38.94 60.02,35.38 9.75,35.38
5.0V
  Top 0.152: U3.3 2.36,34.87 C1.2 2.11,34.87 | C24.2 1.18,32.51 0.75,32.51
  Top 0.305: 5.0V.TP 50.47,30.46 50.46,30.45 | C28.2 4.99,49.86 4.97,49.89 | C27.2 4.97,51.64
  Top 0.406: L3.2 0.75,17.61 0.75,32.51 0.75,34.87 0.93,34.87 2.11,34.87 | U6.5V 4.97,51.64 4.97,49.89 4.97,48.97 4.59,48.59 1.17,48.59 0.74,48.16 0.74,34.87 2.11,34.87 | 2.11,34.87 U3.3 2.11,34.87
  Top 0.61: U3.3 4.5,33.99 5.24,33.25 49.29,33.25 50.46,32.08 50.46,30.45 50.46,26.28 Q5.2
ANTON
  Top 0.305: U5.13 37.71,56.88 38.58,56.01 R6.1
DTR  (via drill 0.35)
  Top 0.152: v11.46,17.73 11.53,17.65 Q2.2 12.45,15.82 R3.1
  Bottom 0.152: U2.15 11.69,17.5 v11.46,17.73
ESP-RXD  (via drill 0.3)
  Top 0.152: U7.37 22.66,8.84 v23.01,9.2 | v27.48,49.33 R38.2
  Bottom 0.152: v23.01,9.2 22.83,9.38 22.83,10.34 21.82,11.35 21.82,43.66 v27.48,49.33
ESP-TXD  (via drill 0.35)
  Top 0.152: R25.2 25.5,49.28 v25.53,49.25 | v22.28,10.11 U7.36
  Bottom 0.152: v25.53,49.25 21.51,45.24 21.51,10.87 v22.28,10.11
GND  (via drill 0.3, 0.35, 0.51 pad 1.02)  (2 unrouted)
  Top 0.152: U1.7 v56.64,75.06 56.64,75.08 56.59,75.14 | R7.1 3.94,12.85 v3.96,12.83 | U1.7 56.59,75.14 | 56.59,75.14 56.26,75.46 v56.26,75.82 | U1.7 56.65,75.45 v57.02,75.82 | U1.7 56.65,74.69 v56.26,74.3 | U1.7 56.65,74.67 v57.02,74.3
  Top 0.254: 2.- | 2.- v1.73,44.81 | 3.- 2.- | 2.- | 1.- 2.- | GND.TP
  Top 0.305: USB1.5 4.41,4.42 v4.38,4.45 | U1.2 U1.7 56.59,75.14 56.59,76.09 56.09,76.59 53.73,76.59 C2.1 | BAT1.- 8.04,71.56 v5.28,74.32 | BAT1.- 11.63,74.59 v11.63,74.6 | BAT1.- 11.6,68.58 v11.63,68.58 | BAT1.- 5.58,68.53 v5.49,68.53 | C21.2 16.41,7.49 v16.43,7.52 | C18.1 11.79,6.1 v12.01,5.87 | C19.1 7.63,6.74 v7.63,7.28 | U3.1 2.95,39.45 v2.92,39.42 | C1.1 v2.11,37.54 | C24.1 3.57,32.55 v3.61,32.51 | C17.1 15.21,34.54 v14.17,34.54 13.16,34.54 C6.1 | 38.27,7.58 38.54,7.32 C7.1 C25.1 42.57,7.31 v42.6,7.34 | U8.4 43.69,11.12 v43.71,11.1 | R11.1 49.17,10.92 v50.04,10.92 | R21.1 53.1,11.29 v53.11,11.28 | C23.1 43.69,20.04 R20.1 43.73,20.77 v43.92,20.95 | C26.1 53.75,22.35 v53.77,22.33 | Q1.2 45.12,27.7 v45.16,27.74 | R24.1 49.28,26.59 v49.28,26.8 | C3.1 v61.92,13.99 | C4.1 v61.87,26.06 | C22.1 56.31,43.97 | 56.31,43.97 C13.1 | 56.31,43.97 56.34,43.94 v58.14,43.94 | C28.1 7.62,49.86 v7.64,49.89 | C27.1 7.57,51.64 v7.59,51.61 | U6.GND v3.76,54.53
  Top 0.508: ANT1.3 26.65,77.28 26.65,78.47 26.5,78.62 19.79,78.62 19.78,78.61 v19.02,78.61 | ANT1.2 32.74,76.96 32.74,78.61 33.98,78.61 33.99,78.62 35,78.62 35,78.61 v35.79,78.61 | U7.38 21.41,7.45 22.29,7.45 v22.29,7.43 | U7.1 38.27,7.58 37.24,7.58 v37.21,7.61 | v35.5,26.48 35.5,25.49 U7.15 | USB1.P2 3.17,4.51 v3.17,5.02 | USB1.P1 2.29,6.92 v2.29,7.37 | U7.P$1 29.46,15.25 v29.46,14.73
  Top 0.61: GND.TP v63.32,5.77 | GND.TP v64.67,4.42 | GND.TP v63.32,3.06 | GND.TP v61.96,4.42
  Bottom 0.152: USB1.P4_1 | USB1.P4_1 v2.48,2.1 | USB1.P4_2 | USB1.P4_2 v2.98,2.1 | USB1.P4_1 | USB1.P4_1 USB1.P4_2 | USB1.P4_1 2.11,2.98 2.13,3 | USB1.P4_2 USB1.P4_3 3.12,3.25 | USB1.P4_1 2.11,1.12 | USB1.P4_1 USB1.P4_2 | USB1.P4_1 2.62,1.59 2.62,1.42 | USB1.P4_2 USB1.P4_3 | USB1.P4_2 3.12,1.59 3.12,1.19 | USB1.P4_2 2.62,3.68 2.59,3.71 | 2.11,10.21 USB1.P3_1 | USB1.P3_2 2.62,10.11 | USB1.P3_2 2.69,9.34 | 2.69,9.34 3.05,9.34 3.17,9.46 3.17,10.13 | 3.12,8.87 3.12,9.17 2.95,9.34 2.69,9.34 | 3.12,8.87 3.12,8.46 | USB1.P3_1 2.59,8.86 2.59,8.53 | USB1.P3_1 2.11,8.64 2.06,8.59 | USB1.P3_2 2.69,9.34 | USB1.P3_3 2.69,9.34 | 2.69,9.34 USB1.P3_2 | USB1.P3_1 USB1.P3_2 | USB1.P3_1 2.69,9.34 | USB1.P3_2 USB1.P3_3 | USB1.P3_3 3.12,8.87
  Bottom 0.305: U2.20 14.91,16.5 14.91,15.93
  Bottom 0.61: 56.64,74.68 v57.02,74.3 v56.26,74.3 56.64,74.68 | 56.64,74.68 v56.64,75.06 | 56.64,75.44 v56.26,75.82 v57.02,75.82 56.64,75.44 | 56.64,75.44 v56.64,75.06 | v56.64,75.06 56.64,52.9 SD1.G1
  other vias: 8.94,35.94 8.94,34.67 7.67,34.67 7.67,35.94 6.4,35.94 6.4,34.67 6.4,38.48 7.67,38.48 8.94,38.48 8.94,39.75 7.67,39.75 6.4,39.75 29.97,17.78 28.96,17.78 27.94,17.78 26.92,17.78 32,17.78 30.99,17.78 31.5,16.76 30.48,16.76 29.46,16.76 28.45,16.76 27.43,16.76 26.92,15.75 27.94,15.75 28.96,15.75 29.97,15.75 30.99,15.75 32,15.75 31.5,14.73 30.48,14.73 28.45,14.73 27.43,14.73 26.92,13.72 27.94,13.72 28.96,13.72 29.97,13.72 30.99,13.72 32,13.72 31.5,12.7 30.48,12.7 29.46,12.7 28.45,12.7 27.43,12.7 2.98,9.33 2.41,9.33 28.68,70.74 43.15,66.67 30.2,66.67 34.01,71.5 38.84,71.5 40.36,71.5 41.88,71.5 28.68,72.01 28.68,69.22 28.68,67.94 28.68,66.67 32.23,71.5 37.31,71.5 43.15,70.23 43.15,68.45 33.25,66.67 31.72,66.67 35.79,71.5 43.79,65.15 43.79,63.37 40.36,65.41 40.36,64.14 34.77,66.67 36.3,66.67 37.82,66.67 39.34,66.67 35.79,77.09 35.79,75.82 35.79,74.3 35.79,72.77 27.15,72.01 25.63,72.01 24.1,72.01 22.58,72.01 21.06,72.01 19.79,72.01 19.02,77.34 19.02,76.07 19.02,74.55 19.02,73.03 43.79,61.85 43.79,60.33 43.79,58.55 43.79,57.02 43.79,55.5 43.03,54.55 42.01,53.72 40.49,53.72 38.96,53.72 37.44,53.72 36.11,53.72 37.44,55.56 36.11,55.56 34.84,55.56 34.84,53.72 2.22,4.06 3.17,6.48
  pour Top (isolate 0.305): 18.26,79.38 18.26,62.87 44.3,62.87 44.3,79.38
  pour Top (rank 4): 44.3,62.87 44.3,51.18 18.26,51.18 18.26,62.87
  pour Bottom: -0.03,0 -0.03,79.38 44.45,79.38 44.45,54.61 71.12,54.61 71.12,0
GPIO0
  Top 0.152: R12.1 21.28,26.23 U7.25 20.02,24.08 Q2.3
MICS_PREHEAT_NOX
  Top 0.152: U7.9 39.48,17.73 40.03,18.29 40.03,22.81 42.65,25.43 46.01,25.43 Q1.1
MICS_PWR
  Top 0.152: Q5.1 51.08,25.12 42.77,25.12 40.34,22.68 40.34,17.63 39.17,16.46 U7.8
N$1
  Top 0.254: R16.1 2.+
N$2
  Top 0.305: U9.C 48.17,15.34 49.01,14.5 52.41,14.5 R21.2
N$3
  Top 0.305: C5.2 C11.2 C9.1
N$4
  Top 0.305: C9.2 C10.2 ANT1.1
N$5
  Top 0.305: U4.3 41.47,65.33 L1.2 41.45,67.18 L2.P$1
N$6
  Top 0.305: R23.2 45.28,22.34 45.28,18.26 45.66,17.88 U9.A
N$7
  Top 0.254: R14.1 7.25,42.94 1.+
N$8
  Top 0.305: L2.P$2 C5.1
N$9
  Top 0.305: U4.5 41.95,63.31 42.39,62.87 42.39,56.95 R6.2
N$10
  Top 0.305: U4.4 C15.2 C12.2 R5.2
N$11
  Top 0.254: R18.2 37.06,61.85 35.38,60.17 U5.16
N$12
  Top 0.152: R3.2 12.19,12.45 Q3.1
N$13
  Top 0.152: Q2.1 12.57,19.43 13.42,18.58 13.42,17.68 14.25,16.86 R1.2
N$14
  Top 0.254: R19.2 35.28,62.36 34.2,61.28 U5.17
N$19  (via drill 3.07)
  other vias: 14.61,3.81
N$20  (via drill 3.07)
  other vias: 67.31,75.56
N$22
  Top 0.152: 4.48,46.51 3.+
  Top 0.254: R2.1 4.48,46.51
N$23  (1 unrouted)
  Top 0.152: Q1.3 46.02,24.27 46.02,24.23
  Top 0.305: 46.02,24.23 46.02,23.65 46.89,22.78 R23.1 | R24.2 46.04,24.26
N$24
  Top 0.152: C26.2 51.32,22.44 Q5.3 | U9.G U9.H 51.42,16.59 51.37,16.54
  Top 0.813: Q5.3 51.32,20.06 | U9.F 51.37,15.39 51.37,16.54 51.37,20.02 51.33,20.06 51.32,20.06 | 51.32,20.06 U9.J
N$25
  Top 0.305: R7.2 1.62,11.17 4.-
N$26  (via drill 0.35)
  Top 0.152: USB1.2 6.59,6.37 v6.6,6.35
  Bottom 0.152: U2.7 11.04,6.88 10.51,6.35 6.73,6.35 v6.6,6.35
N$27  (via drill 0.35)
  Top 0.152: USB1.3 6.43,5.71 v6.6,5.54
  Bottom 0.152: v6.6,5.54 6.82,5.76 10.83,5.76 11.69,6.62 U2.6
N$28  (via drill 0.35)
  Top 0.152: v9.88,8.04 9.76,8.04 9.76,5.25 C18.2 10.75,4.25 10.75,2.79 Y1.2
  Bottom 0.152: U2.9 9.74,8.17 v9.88,8.04
N$29  (via drill 0.35)
  Top 0.152: 7.75,2.16 8.02,2.43 8.02,4.32 C19.2 9.04,5.34 v9.04,8.03 | 7.75,2.16 7.81,2.1 | Y1.1 7.32,2.16 7.75,2.16
  Bottom 0.152: U2.10 9.09,8.07 v9.04,8.03
N$30  (via drill 0.35)
  Top 0.152: v16.51,12.95 R34.2
  Bottom 0.152: U2.3 13.64,10.17 14.07,10.6 16.74,10.6 17.09,10.96 17.09,12.37 v16.51,12.95
N$33
  Top 0.152: U7.35 21.2,11.3 19.25,11.3 R33.2
N$36
  Top 0.152: U6.TXD R37.2
N$37
  Top 0.61: R13.1 RELOAD.3
N$38
  Top 0.61: RESET.3 63.8,11.91 R4.1
PM_RESET  (via drill 0.35)
  Top 0.152: U6.RESET 6.18,59.53 v6.2,59.51 | v37.29,18.92 37.37,19 U7.10
  Bottom 0.152: v6.2,59.51 6.2,57.86 18.87,45.19 18.87,7.7 19.79,6.78 37.29,6.78 38.05,7.54 38.05,18.16 v37.29,18.92
PM_SET  (via drill 0.35)
  Top 0.152: U6.SET v6.14,55.78 v6.15,55.78 | v18.29,19 U7.29
  Bottom 0.152: v6.15,55.78 6.15,54.97 18.29,42.82 v18.29,19
RELOAD  (via drill 0.3)
  Top 0.152: U7.4 39.32,11.38 v39.42,11.48
  Top 0.61: C4.2 61.87,29.06 RELOAD.2
  Bottom 0.152: v39.42,11.48 40.34,12.39 40.34,18.75 52.65,31.06 RELOAD.2
RESET  (via drill 0.3, 0.35)
  Top 0.152: Q3.3 17.75,8.03 v19.43,8.03 | v36.88,9.98 38.2,9.98 38.28,10.06 U7.3 38.35,10.19 v39.47,10.19
  Top 0.61: RESET.2 61.92,17.4 C3.2
  Bottom 0.152: v19.43,8.03 34.93,8.03 v36.88,9.98 | RESET.2 54.71,10.19 v39.47,10.19
RF_IN
  Top 0.305: U4.6 42.45,63.57 42.9,63.12 42.9,55.75 41.82,54.67 U5.11
RTS  (via drill 0.35)
  Top 0.152: v13.24,14.94 13.46,14.94 R1.1 13.5,13.4 13.5,11.46 Q3.2
  Bottom 0.152: v13.24,14.94 12.84,14.94 12.34,15.44 U2.16
RXD0
  Top 0.152: U7.34 19.42,12.65 R34.1
SCL  (via drill 0.35)
  Top 0.152: U7.12 38.38,21.54 38.38,21.44 v39.4,21.44 | v60.22,36.93 60.22,38.48 | 60.22,38.48 60.22,68.76 55.22,73.77 U1.6 | R22.1 60.21,38.5 60.22,38.48
  Bottom 0.152: v39.4,21.44 39.8,21.44 51.99,33.63 56.92,33.63 v60.22,36.93
SD_CLK_IO14  (via drill 0.35)
  Top 0.152: U7.13 39.32,22.81 v39.37,22.86
  Bottom 0.152: v39.37,22.86 52.76,36.25 | 52.76,36.25 57.53,41.02 57.53,46.61 57.03,47.11 SD1.5 | R15.1 52.57,36.06 52.76,36.25
SD_CMD_IO15  (via drill 0.35)
  Top 0.152: U7.23 25.32,26.29 25.86,26.82 v26.21,26.82
  Bottom 0.152: v26.21,26.82 28.5,26.82 46.58,44.91 SD1.3 53.44,44.91 R17.1
SD_CS_IO13  (via drill 0.35)
  Top 0.152: U7.16 34.21,26.49 v34.16,26.54
  Bottom 0.152: v34.16,26.54 34.16,28.68 49.29,43.81 53.29,43.81 | 53.29,43.81 SD1.2 | R8.1 53.29,43.37 53.29,43.81
SD_D0_IO2  (via drill 0.35)
  Top 0.152: U7.24 24.05,26.49 | 24.05,26.49 v24,26.54 | R12.2 23.34,27.2 24.05,26.49
  Bottom 0.152: v24,26.54 24,27.8 45.51,49.31 SD1.7 53.51,49.31 R9.1
SD_D1_IO4  (via drill 0.35)
  Top 0.152: U7.26 23.39,22.81 v23.42,22.78
  Bottom 0.152: SD1.8 44.65,50.41 22.84,28.59 22.84,23.36 v23.42,22.78
SD_D2_IO12  (via drill 0.3)
  Top 0.152: v38.3,25.04 38.3,24.11 U7.14
  Bottom 0.152: SD1.1 54.59,41.16 53.52,41.16 38.3,25.95 v38.3,25.04
SDA  (via drill 0.35)
  Top 0.152: v39.42,19.68 38.83,20.27 U7.11 | 61.33,38.48 61.33,68.42 58.09,71.66 U1.1 | 61.33,38.48 v61.33,35.55 | R10.1 61.33,38.48
  Bottom 0.152: v39.42,19.68 51.87,32.13 57.91,32.13 v61.33,35.55
STAT_LED1  (via drill 0.35)
  Top 0.152: R14.2 10.11,43.1 v10.13,43.08 | v16.31,13.92 U7.33
  Bottom 0.152: v10.13,43.08 11.35,44.3 14.43,44.3 16.61,42.11 16.61,14.22 v16.31,13.92
STAT_LED2  (via drill 0.35)
  Top 0.152: R16.2 10.03,44.81 v10.06,44.78 | v17.25,16.54 21.21,16.54 U7.31
  Bottom 0.152: v10.06,44.78 14.76,44.78 17.17,42.37 17.17,16.61 v17.25,16.54
STAT_LED3  (via drill 0.35)
  Top 0.152: R2.2 10.01,46.51 v10.06,46.46 | v17.73,17.75 21.26,17.75 U7.30
  Bottom 0.152: v10.06,46.46 11.15,45.36 14.96,45.36 17.73,42.6 v17.73,17.75
TXD0  (via drill 0.35)
  Top 0.152: v16.51,11.18 R33.1
  Bottom 0.152: U2.4 12.99,10.2 13.97,11.18 v16.51,11.18
U1RXD
  Top 0.152: U5.3 23.6,60.21 24.76,60.21 25.5,59.46 R25.1
U1TXD
  Top 0.152: U5.2 25.15,61.28 27.49,58.94 R38.1
U2RXD  (via drill 0.35)
  Top 0.152: R37.1 v8.72,57.08 v8.71,57.07 | v19.43,21.57 21.26,21.57 U7.27
  Bottom 0.152: v8.71,57.07 19.43,46.35 v19.43,21.57
V_BCKP
  Top 0.61: U5.6 17.01,56.88 15.34,58.55 BAT1.+2
  Bottom 0.61: BAT1.+1 8.56,71.56 BAT1.+2
VBUS
  Top 0.406: L3.1 7.3,9.28 7.3,7.88 6.46,7.04 5.55,7.04 USB1.1
VCC_RF
  Top 0.305: U5.14 R5.1
VOX_RAWA
  Top 0.305: U9.B U8.5 43.73,16.64 R20.2
VOX_RAWB
  Top 0.305: U8.6 U8.7 42.39,15.44 42.14,15.19 U7.7
VRED_RAWA
  Top 0.305: U8.3 43.03,13.54 43.34,13.85 47.7,13.85 U9.D 47.7,10.99 R11.2
VRED_RAWB
  Top 0.305: U8.2 U8.1 41.76,12.22 41.76,13.61 41.45,13.92 U7.6

### Text on the board
tPlace: Texas Instruments HDC1080 / Temperature and Humidity | AirU v2.2 / July 22, 2020 | GPS+RTC | ESP32 WROOM | MiCS 4514 / CO + NOx